# EAGLE design path_panel (EAGLE 7.2.0)
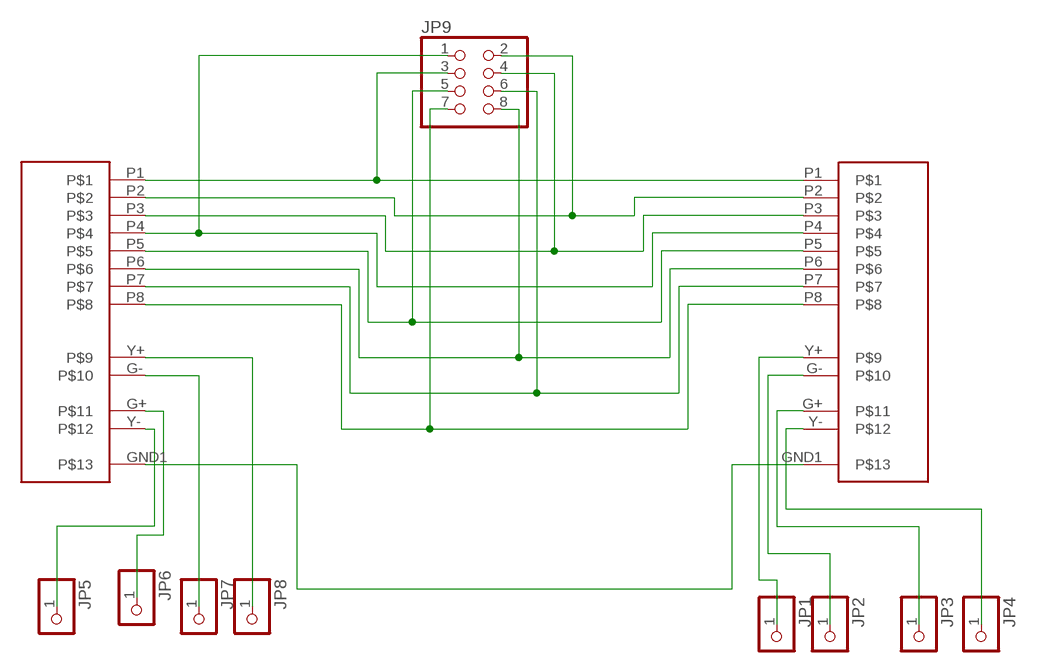
[diagram p0: schematic, sheet 1]

## Parts
JP1  PINHD-1X1  [1X01]
JP2  PINHD-1X1  [1X01]
JP3  PINHD-1X1  [1X01]
JP4  PINHD-1X1  [1X01]
JP5  PINHD-1X1  [1X01]
JP6  PINHD-1X1  [1X01]
JP7  PINHD-1X1  [1X01]
JP8  PINHD-1X1  [1X01]
JP9  PINHD-2X4  [2X04]
U$14  RJ-45_LEDS  [RJ-45_LEDS]
U$15  RJ-45_LEDS  [RJ-45_LEDS]

## Nets
N$1: JP9.3 U$14.P1 U$15.P1
N$2: U$14.GND1 U$15.GND1
N$3: JP5.1 U$14.Y-
N$4: JP6.1 U$14.G+
N$5: JP7.1 U$14.G-
N$6: JP8.1 U$14.Y+
N$7: JP4.1 U$15.Y-
N$8: JP3.1 U$15.G+
N$9: JP2.1 U$15.G-
N$10: JP1.1 U$15.Y+
N$14: JP9.2 U$14.P2 U$15.P2
N$15: JP9.4 U$14.P3 U$15.P3
N$16: JP9.1 U$14.P4 U$15.P4
N$17: JP9.5 U$14.P5 U$15.P5
N$18: JP9.8 U$14.P6 U$15.P6
N$19: JP9.6 U$14.P7 U$15.P7
N$20: JP9.7 U$14.P8 U$15.P8

## Library data of the parts
JP1-JP8 = adafruit:PINHD-1X1: Pin header 1x1 for 0.1" spacing With round pins
JP9 = pinhead:PINHD-2X4: PIN HEADER
U$14 U$15 = con-pc:RJ-45_LEDS: RJ-45 connector with 2 leds

## Board
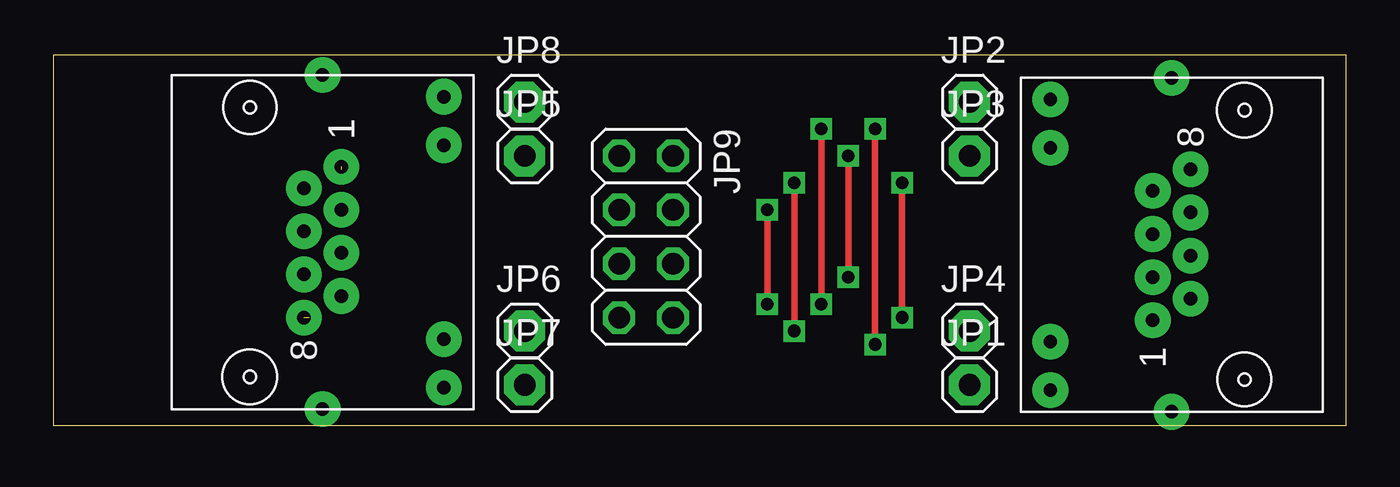
[diagram p1: board, top side]
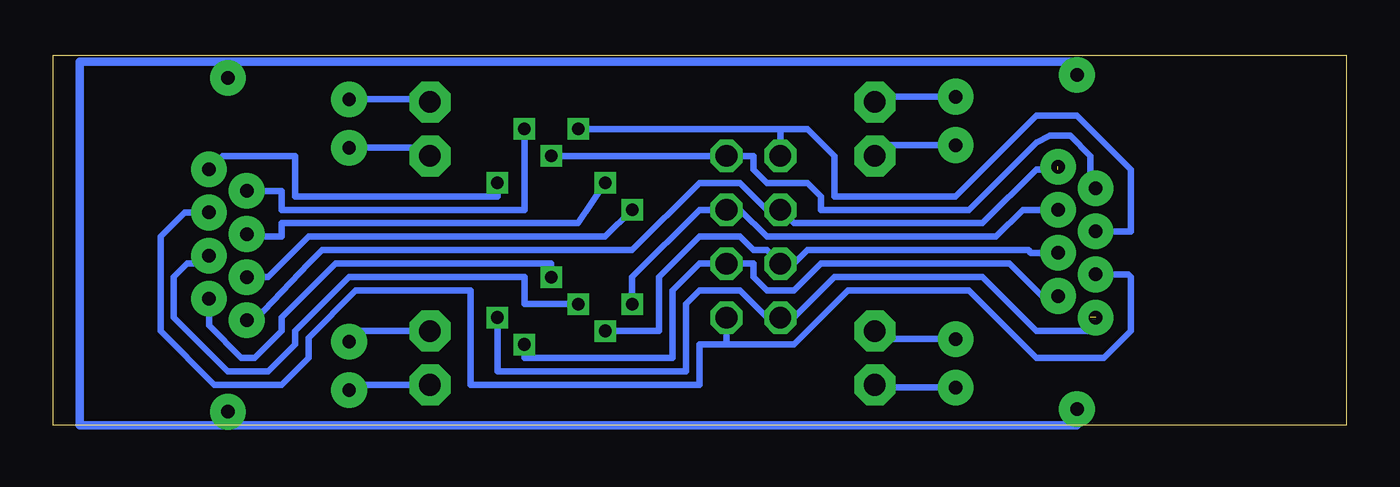
[diagram p2: board, bottom side, seen from below]

Size 60.94 x 17.45 mm. Coordinates in mm from the lower left corner, seen from the top.
Outline: 0,0 60.94,0 60.94,17.45 0,17.45 0,0
Copper layers (1*16): Top 0.035mm / dielectric 1.5mm / Bottom 0.035mm
Design rules "default *": minimum track width 10mil, minimum drill 24mil, track to track 8mil, track to pad 8mil, pad to pad 8mil, via to via 8mil, smd to smd 8mil, copper to edge 40mil, drill to drill 8mil, minimum pad ring 10mil, minimum via ring 8mil, stop-mask expansion 4mil, vias tented up to drill 0mil, thermal gap 10mil

### Footprints (pad centres in the part's own frame; a part is rotated, then mirrored left to right if it is on the bottom)
1X01 = drill 1.016 pad 1.93 octagon: 1 0,0
2X04 = drill 1.016 octagon: 1 -3.81,-1.27; 2 -3.81,1.27; 3 -1.27,-1.27; 4 -1.27,1.27; 5 1.27,-1.27; 6 1.27,1.27; 7 3.81,-1.27; 8 3.81,1.27
RJ-45_LEDS = drill 0.635 pad 1.676: G+ -9.525,4.826; G- -9.525,7.112; GND -3.81,-7.62; GND1 -3.81,8.128; P1 -4.699,-3.302; P2 -2.921,-2.286; P3 -4.699,-1.27; P4 -2.921,-0.254; P5 -4.699,0.762; P6 -2.921,1.778; P7 -4.699,2.794; P8 -2.921,3.81; Y+ -9.525,-6.604; Y- -9.525,-4.318

### Placement (x,y rotation side)
JP1  43.18,1.9 0 top
JP2  43.18,15.24 0 top
JP3  43.18,12.7 0 top
JP4  43.18,4.44 0 top
JP5  22.22,12.7 0 top
JP6  22.22,4.44 0 top
JP7  22.22,1.9 0 top
JP8  22.22,15.24 0 top
JP9  27.94,8.89 270 top
U$14  8.89,8.89 180 top
U$15  56.52,8.26 0 top

### Tracks (layer width: path | path; a pad name or v marks a point on that pad's centre or on a via)
N$1  (1 unrouted)
  Bottom 0.305: U$15.P1 51.44,4.95 48.9,7.62 48.26,8.26 33.66,8.26 30.48,11.43 28.57,11.43 27.3,10.16 JP9.3 26.04,9.53 17.14,9.53 14.61,12.06 13.59,12.06
N$2
  Bottom 0.406: U$15.GND1 52.71,17.14 | 52.71,17.14 59.69,17.14 59.69,0 12.7,0 U$14.GND1 | 52.71,17.14 12.7,17.14
N$3
  Bottom 0.305: U$14.Y- 21.72,13.21 JP5.1
N$4
  Bottom 0.305: U$14.G+ 21.84,4.06 JP6.1
N$5
  Bottom 0.305: U$14.G- 22.1,1.78 JP7.1
N$6
  Bottom 0.305: U$14.Y+ 21.97,15.49 JP8.1
N$7
  Bottom 0.305: JP4.1 46.48,4.44 U$15.Y-
N$8
  Bottom 0.305: JP3.1 43.56,13.08 U$15.G+
N$9
  Bottom 0.305: JP2.1 43.31,15.37 U$15.G-
N$10
  Bottom 0.305: JP1.1 46.74,1.9 U$15.Y+
N$14  (via drill 0.6)
  Top 0.305: v37.47,12.7 v37.47,6.98
  Bottom 0.305: U$14.P2 12.06,11.43 12.06,12.7 13.02,13.65 13.97,13.65 14.61,13.33 17.78,10.16 24.76,10.16 24.76,10.79 25.4,11.43 27.3,11.43 27.94,12.06 27.94,12.7 JP9.2 v37.47,12.7 | v37.47,6.98 37.47,7.62 47.62,7.62 50.16,5.08 50.16,4.44 51.44,3.17 52.07,3.17 53.59,4.7 U$15.P2
N$15  (via drill 0.6)
  Top 0.305: v33.66,10.16 v33.66,5.71
  Bottom 0.305: U$15.P3 50.8,6.98 48.9,8.89 34.93,8.89 v33.66,10.16 | v33.66,5.71 33.66,6.98 30.48,10.16 JP9.4 28.57,10.16 27.3,8.89 16.51,8.89 15.24,10.16 U$14.P3
N$16  (via drill 0.6)
  Top 0.305: v36.2,13.97 v36.2,5.71
  Bottom 0.305: U$14.P4 10.16,9.14 10.16,12.06 12.7,14.6 14.61,14.6 18.41,10.79 24.13,10.79 24.13,12.7 25.4,13.97 26.67,13.97 | 26.67,13.97 v36.2,13.97 | U$15.P4 53.98,7.62 54.61,7.62 55.25,6.98 55.25,5.08 52.71,2.54 50.8,2.54 49.53,3.81 49.53,4.44 46.99,6.98 38.73,6.98 38.73,5.71 v36.2,5.71 | JP9.1 26.67,13.97
N$17  (via drill 0.6)
  Top 0.305: v34.93,11.43 v34.93,4.44
  Bottom 0.305: U$15.P5 51.69,8.89 50.16,8.89 50.16,9.53 36.2,9.53 v34.93,11.43 | v34.93,4.44 32.39,4.44 32.39,6.98 30.48,8.89 28.57,8.89 27.94,8.26 27.3,8.26 JP9.5 26.04,7.62 25.4,8.26 14.99,8.26 14.86,8.13 U$14.P5
N$18
  Bottom 0.305: U$14.P6 10.29,7.11 10.16,6.98 10.16,4.44 11.43,3.17 14.61,3.17 17.78,6.35 23.49,6.35 26.04,3.81 29.21,3.81 | 29.21,3.81 30.48,3.81 30.48,1.9 41.27,1.9 41.27,6.35 46.67,6.35 48.9,4.13 48.9,3.17 50.16,1.9 53.34,1.9 55.88,4.44 55.88,8.89 54.74,10.03 U$15.P6 | JP9.8 29.21,3.81
N$19  (via drill 0.6)
  Top 0.305: v38.73,13.97 v38.73,3.81
  Bottom 0.305: U$15.P7 50.16,11.05 50.16,10.16 38.73,10.16 v38.73,13.97 | v38.73,3.81 38.73,3.17 31.75,3.17 31.75,6.35 30.48,7.62 JP9.6 27.94,7.62 27.94,6.98 27.3,6.35 26.04,6.35 24.76,7.62 15.88,7.62 14.35,6.1 U$14.P7
N$20  (via drill 0.6)  (1 unrouted)
  Top 0.305: v40.01,5.08 v40.01,11.43
  Bottom 0.305: v40.01,5.08 40.01,2.54 31.11,2.54 31.11,5.71 30.48,6.35 28.57,6.35 27.3,5.08 JP9.7 26.04,5.08 24.13,6.98 17.14,6.98 14.61,4.44 12.06,4.44 12.06,5.08 | v40.01,11.43 40.01,10.79 49.53,10.79 49.53,12.7 52.96,12.7 U$15.P8